# Altium schematic sheet BRD9057A_SiWx917M_4-Layer_ExtSw_REF_DES_A01_Page_1.SchDoc: =TitlePage1
size A3; Organization: Altium Limited; Address1: L3, 12a Rodborough Rd; Address2: Frenchs Forest; Address3: NSW; Address4: Australia 2086; SheetNumber: 1; SheetTotal: 5
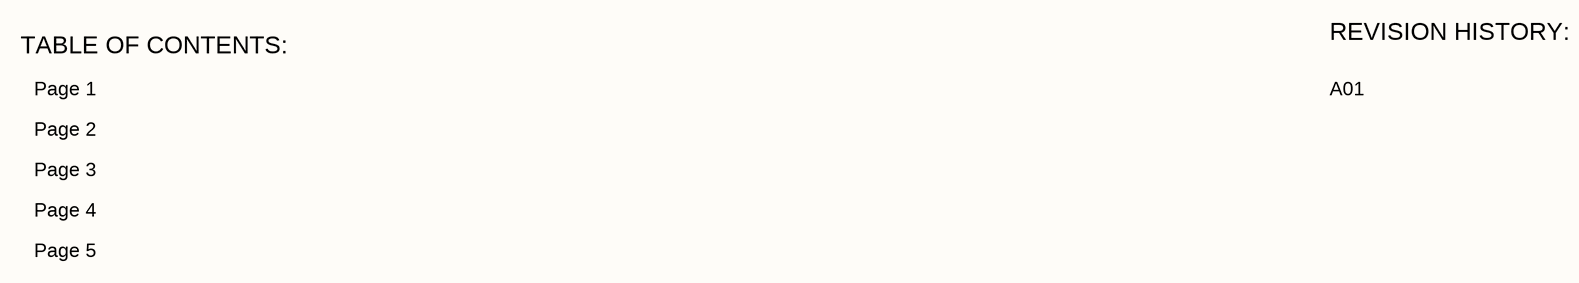
[diagram p0: BRD9057A_SiWx917M_4-Layer_ExtSw_REF_DES_A01_Page_1.SchDoc]

## Notes on the sheet
- TABLE OF CONTENTS:
- REVISION HISTORY:
- Page 1
- Page 2
- A01
- Page 3
- Page 4
- Page 5
- Board name
- Designed
- Approved
- Page Title
- Size
- A3
- Sheet Modified Date
- Board number
- BRD
- Revision
- Sheet
- COPYRIGHT SILICON LABORATORIES INC.
- CONFIDENTIAL - SUBJECT TO TERMS OF USE
- of